# EAGLE design LNA_V4 (EAGLE 7.5.0)
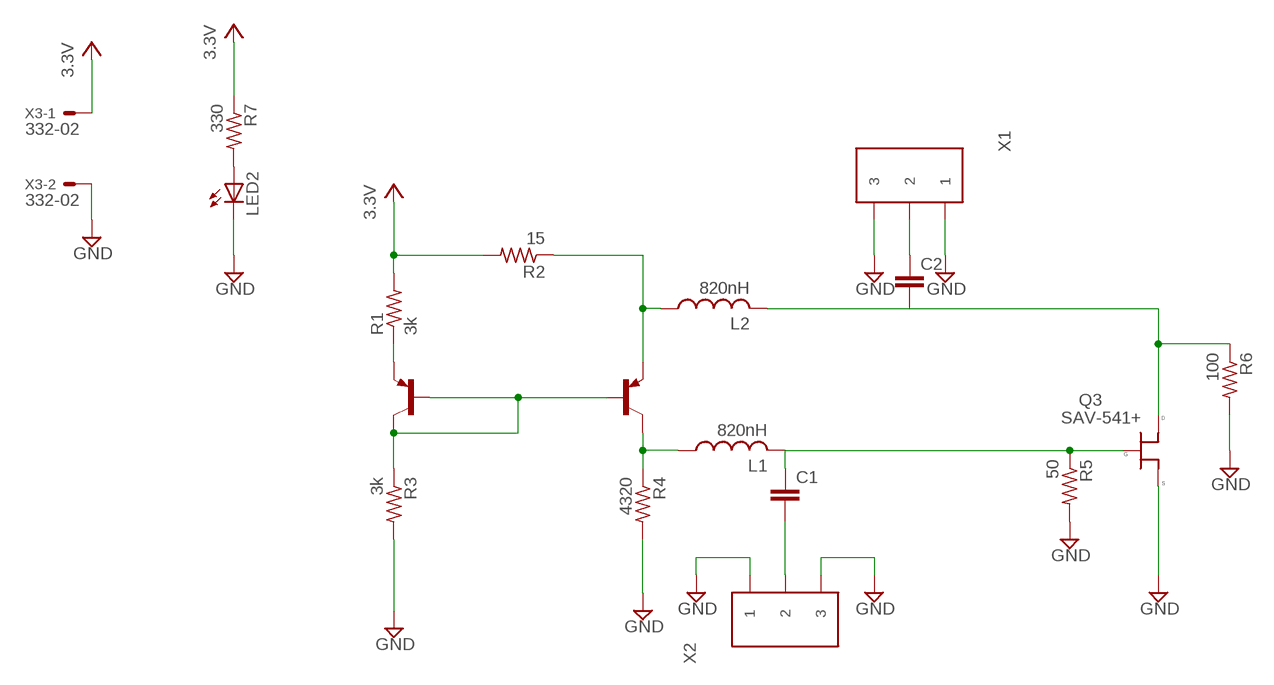
[diagram p0: schematic, sheet 1]

## Parts
C1  C-EUC0603  [C0603]
C2  C-EUC0603  [C0603]
L1  820nH  L-USL3225M  [L3225M]
L2  820nH  L-USL3225M  [L3225M]
LED2  LEDCHIPLED_0805  [CHIPLED_0805]
Q1  MMBT3906LT1SMD  [SOT23-BEC]
Q2  MMBT3906LT1SMD  [SOT23-BEC]
Q3  SAV-541+  [SOT-343]
R1  3k  R-US_M0805  [M0805]
R2  15  R-US_M0805  [M0805]
R3  3k  R-US_M0805  [M0805]
R4  4320  R-US_M0805  [M0805]
R5  50  R-US_M0805  [M0805]
R6  100  R-US_M0805  [M0805]
R7  330  R-US_M0805  [M0805]
X1  PROBE_LANDING  [PROBE_LANDING]
X2  PROBE_LANDING  [PROBE_LANDING]
X3  332-02  [332-02]

## Nets
+3.3V: R1.2 R2.2 R7.1 X3.1 ; supply symbol labelled 3.3V
GND: LED2.C Q3.2(S) Q3.4(S) R3.2 R4.2 R5.2 R6.2 X1.1 X1.3 X2.1 X2.3 X3.2
INPUT: C1.1 L1.2 Q3.3(G) R5.1
ISO_INPUT: C1.2 X2.2
ISO_OUTPUT: C2.1
N$1: Q1.B Q1.C Q2.B R3.1
N$2: LED2.A R7.2
N$4: Q1.E R1.1
OUTPUT: C2.2 L2.2 Q3.1(D) R6.1
VD: L2.1 Q2.E R2.1
VG: L1.1 Q2.C R4.1
Unconnected: X1.2

## Library data of the parts
C1 C2 = rcl:C-EU: CAPACITOR, European symbol
L1 L2 = resistor:L-US: INDUCTOR, American symbol
LED2 = led:LED: LED OSRAM: - CHIPLED LG R971, LG N971, LY N971, LG Q971, LY Q971, LO R971, LY R971 LH N974, LH R974 LS Q976, LO Q976, LY Q976 LO Q996 - Hyper CHIPLED LW Q18S LB Q993, LB Q99A, LB R99A - SideLED LS A670, LO A670, LY A670, LG A670, LP A670 LB A673, LV A673, LT A673, LW A673 LH A674 LY A675 LS A676, LA A676, LO A676, LY A676, LW A676 LS A679, LY A679, LG A679 - Hyper Micro SIDELED® LS Y876, LA Y876, LO Y876, LY Y876 LT Y87S - SmartLED LW L88C, LW L88S LB L89C, LB L89S, LG L890 LS L89K, LO L89K, LY L89K LS L896, LA L896, LO L896, LY L896 - TOPLED LS T670, LO T670, LY T670, LG T670, LP T670 LSG T670, LSP T670, LSY T670, LOP T670, LYG T670 LG T671, LOG T671, LSG T671 LB T673, LV T673, LT T673, LW T673 LH T674 LS T676, LA T676, LO T676, LY T676, LB T676, LH T676, LSB T676, LW T676 LB T67C, LV T67C, LT T67C, LS T67K, LO T67K, LY T67K, LW E67C LS E67B, LA E67B, LO E67B, LY E67B, LB E67C, LV E67C, LT E67C LW T67C LS T679, LY T679, LG T679 LS T770, LO T770, LY T770, LG T770, LP T770 LB T773, LV T773, LT T773, LW T773 LH T774 LS E675, LA E675, LY E675, LS T675 LS T776, LA T776, LO T776, LY T776, LB T776 LHGB T686 LT T68C, LB T68C - Hyper Mini TOPLED® LB M676 - Mini TOPLED Santana® LG M470 LS M47K, LO M47K, LY M47K Source: http://www.osram.convergy.de LUXEON: - LUMILED® LXK2-PW12-R00, LXK2-PW12-S00, LXK2-PW14-U00, LXK2-PW14-V00 LXK2-PM12-R00, LXK2-PM12-S00, LXK2-PM14-U00 LXK2-PE12-Q00, LXK2-PE12-R00, LXK2-PE12-S00, LXK2-PE14-T00, LXK2-PE14-U00 LXK2-PB12-K00, LXK2-PB12-L00, LXK2-PB12-M00, LXK2-PB14-N00, LXK2-PB14-P00, LXK2-PB14-Q00 LXK2-PR12-L00, LXK2-PR12-M00, LXK2-PR14-Q00, LXK2-PR14-R00 LXK2-PD12-Q00, LXK2-PD12-R00, LXK2-PD12-S00 LXK2-PH12-R00, LXK2-PH12-S00 LXK2-PL12-P00, LXK2-PL12-Q00, LXK2-PL12-R00 Source: www.luxeon.com KINGBRIGHT: KA-3528ASYC Source: www.kingbright.com
Q1 Q2 = transistor-pnp:MMBT3906*: PNP Transistror
Q3 = ECE532_Parts:SAV-541+
R1-R7 = rcl:R-US_: RESISTOR, American symbol
X1 X2 = ECE532_Parts:PROBE_LANDING
X3 = con-garry:332-02: 2 Pin - 2mm Dual Row Source: www.mpe-connector.de / garry_shortform_2012.pdf

## Board
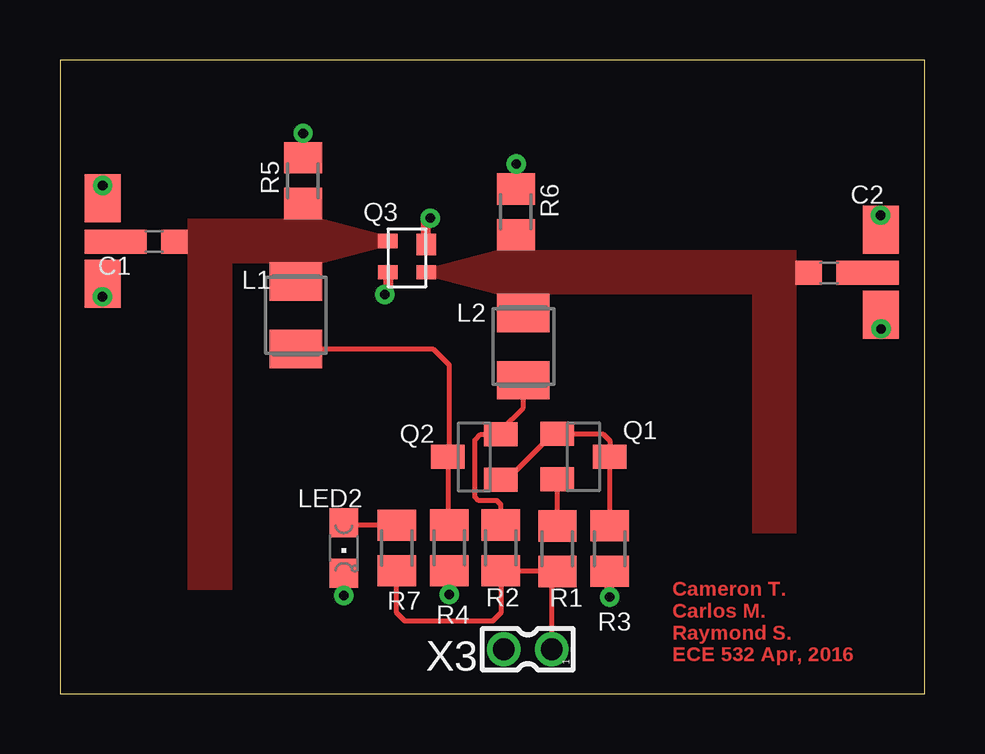
[diagram p1: board, top side]
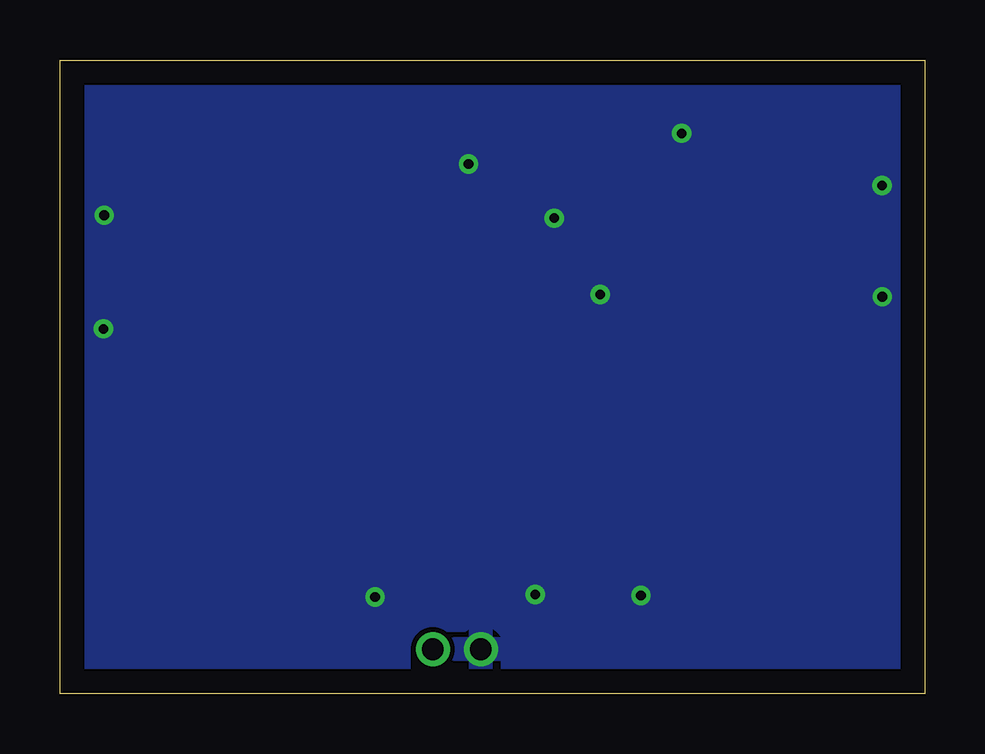
[diagram p2: board, bottom side, seen from below]

Size 36.05 x 26.4 mm. Coordinates in mm from the lower left corner, seen from the top.
Outline: 0,0 36.05,0 36.05,26.4 0,26.4 0,0
Copper layers (1*16): Top 0.035mm / dielectric 1.5mm / Bottom 0.035mm
Design rules "default": minimum track width 10mil, minimum drill 24mil, track to track 8mil, track to pad 8mil, pad to pad 8mil, via to via 8mil, smd to smd 8mil, copper to edge 40mil, drill to drill 8mil, minimum pad ring 10mil, minimum via ring 8mil, stop-mask expansion 4mil, vias tented up to drill 0mil, thermal gap 10mil

### Footprints (pad centres in the part's own frame; a part is rotated, then mirrored left to right if it is on the bottom)
C0603 = smd 1.1 x 1: 1 -0.85,0; 2 0.85,0
L3225M = smd 1.6 x 2.2: 1 -1.4,0; 2 1.4,0
CHIPLED_0805 = smd 1.2 x 1.2: A 0,-1.05; C 0,1.05
SOT23-BEC = smd 1 x 1.4: B -0.95,-1.1; C 0,1.1; E 0.95,-1.1
SOT-343 = smd 0.6 x 0.8: 1 1.3,1.6; 3 0,0; 4 1.3,0 | smd 0.9 x 0.8: 2 0.15,1.6
M0805 = smd 1.3 x 1.6: 1 -0.95,0; 2 0.95,0
PROBE_LANDING = smd 1.5 x 2: 1 0,1.8; 3 0,-1.75 | smd 1.5 x 1: 2 0,0
332-02 = drill 0.9 pad 1.27: 1 0,-1; 2 0,1

### Placement (x,y rotation side)
C1  3.92,18.84 180 top
C2  32.06,17.53 180 top
L1  9.83,15.77 90 top
L2  19.31,14.46 90 top
LED2  11.83,6.06 180 top
Q1  21.82,9.87 270 top
Q2  17.27,9.86 90 top
Q3  13.67,18.86 270 top
R1  20.74,6.04 270 top
R2  18.38,6.07 270 top
R3  22.92,6.04 270 top
R4  16.23,6.07 270 top
R5  10.13,21.37 90 top
R6  19.01,20.07 90 top
R7  14.03,6.06 90 top
X1  34.21,17.53 0 top
X2  1.77,18.84 0 top
X3  19.5,1.85 90 top

### Tracks (layer width: path | path; a pad name or v marks a point on that pad's centre or on a via)
+3.3V
  Top 0.203: X3.1 20.5,4.85 R1.2 20.7,5.12 R2.2 18.38,3.36 18.04,3.02 14.39,3.02 14.04,3.37 R7.1
GND  (via drill 0.4)
  Top 0.203: v10.14,23.34 R5.2 | v19.02,22.07 19.02,21.07 R6.2 | LED2.C v11.84,4.08 v11.83,4.08
  Top 0.254: v34.21,19.93 X1.1 | v34.23,15.2 34.21,15.2 X1.3 | v1.77,16.54 X2.3 | 1.77,20.19 X2.1 v1.77,21.17 v1.78,21.17
  Top 0.406: Q3.2 15.27,19.64 v15.44,19.81 | Q3.4 13.67,16.77 v13.54,16.63 | v22.91,4.03 22.91,4.88 R3.2 | v16.23,4.13 R4.2
  pour Bottom: 53.53,-21.57 54.13,71.16 -7.05,71.86 -7.8,-21.17
INPUT
  pour Top (no thermals): 5.32,19.78 10.93,19.78 10.93,17.93 5.32,17.93
  pour Top (no thermals): 13.47,19.11 10.93,19.78 10.93,17.93 13.47,18.6
ISO_INPUT
  Top 0.203: X2.2 C1.2 | C1.2
N$1
  Top 0.203: Q2.B 18.62,8.91 20.22,10.5 20.4,10.5 Q1.B 22.63,10.82 22.92,10.54 Q1.C R3.1
N$2
  Top 0.203: R7.2 11.94,7.02 LED2.A
N$4
  Top 0.203: Q1.E 20.72,7 R1.1
N$6
  pour Top (no thermals): 7.17,4.33 7.17,17.93 5.32,17.93 5.32,4.33
N$8
  pour Top (no thermals): 30.7,6.67 30.7,16.63 28.85,16.63 28.85,6.67
OUTPUT
  pour Top (no thermals): 18.2,16.63 30.7,16.63 30.7,18.48 18.2,18.48
  pour Top (no thermals): 15.66,17.3 18.2,16.63 18.2,18.48 15.66,17.81
VD
  Top 0.203: R2.1 18.38,7.87 18.21,8.04 17.45,8.04 17.3,8.19 17.3,10.56 17.54,10.8 18.36,10.8 Q2.E 18.37,10.96 19.32,11.91 L2.1
VG
  Top 0.203: L1.1 15.55,14.36 16.22,13.69 16.22,9.91 Q2.C 16.17,7.09 R4.1

### Text on the board
Top: Cameron T. / Carlos M. / Raymond S. / ECE 532 Apr, 2016